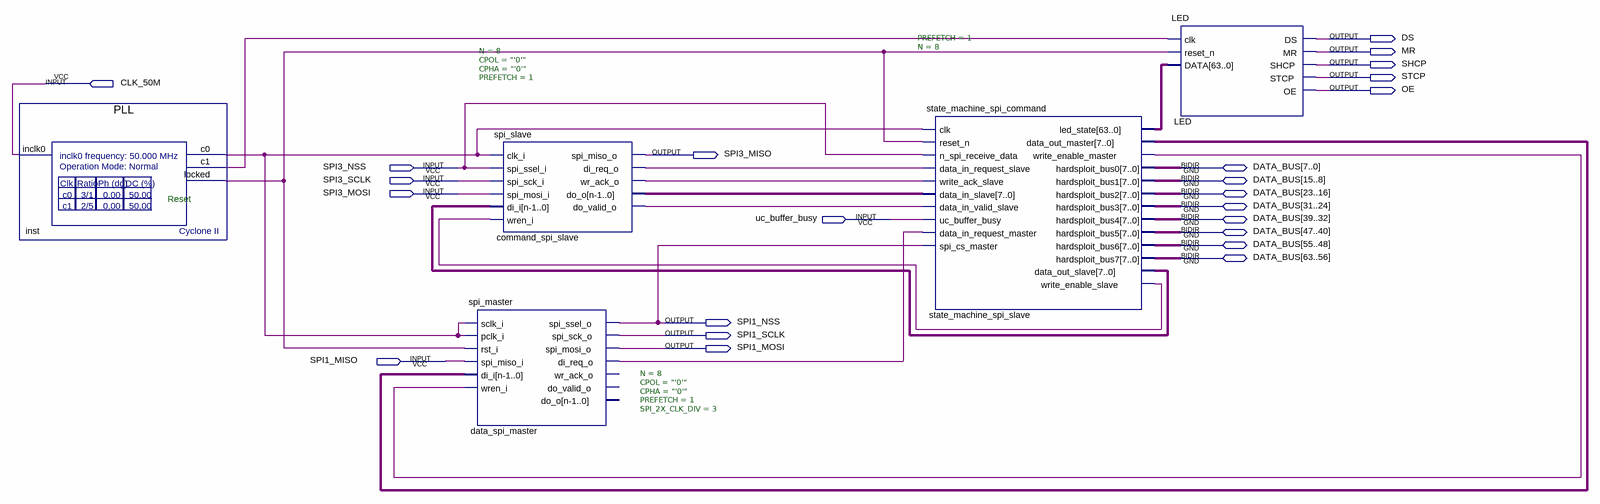
[diagram p0: schematic sheet]
// Quartus schematic HARDSPLOIT_TEMPLATE.bdf as structural Verilog: 5 symbols, 23 pins
module HARDSPLOIT_TEMPLATE (
  input  CLK_50M,
  input  SPI3_NSS,
  input  SPI3_SCLK,
  input  SPI3_MOSI,
  input  uc_buffer_busy,
  input  SPI1_MISO,
  inout  [63:0] DATA_BUS,
  output DS,
  output MR,
  output SHCP,
  output STCP,
  output OE,
  output SPI3_MISO,
  output SPI1_NSS,
  output SPI1_SCLK,
  output SPI1_MOSI
);

  wire command_spi_slave_di_req_o, command_spi_slave_do_valid_o, command_spi_slave_wr_ack_o,
       data_spi_master_di_req_o, inst_c0, inst_c1, inst_locked, state_machine_spi_slave_write_enable_master,
       state_machine_spi_slave_write_enable_slave;
  wire [7:0] command_spi_slave_do_o, state_machine_spi_slave_data_out_master,
       state_machine_spi_slave_data_out_slave;
  wire [63:0] state_machine_spi_slave_led_state;

  PLL inst (.inclk0(CLK_50M), .c0(inst_c0), .c1(inst_c1), .locked(inst_locked));
  spi_master #(.N(8), .CPOL("'0'"), .CPHA("'0'"), .PREFETCH(1), .SPI_2X_CLK_DIV(3)) data_spi_master (
    .sclk_i(inst_c0), .pclk_i(inst_c0), .rst_i(inst_locked), .spi_miso_i(SPI1_MISO),
    .di_i(state_machine_spi_slave_data_out_master), .wren_i(state_machine_spi_slave_write_enable_master),
    .spi_ssel_o(SPI1_NSS), .spi_sck_o(SPI1_SCLK), .spi_mosi_o(SPI1_MOSI), .di_req_o(data_spi_master_di_req_o));  // open: wr_ack_o, do_valid_o, do_o
  spi_slave #(.N(8), .CPOL("'0'"), .CPHA("'0'"), .PREFETCH(1)) command_spi_slave (
    .clk_i(inst_c0), .spi_ssel_i(SPI3_NSS), .spi_sck_i(SPI3_SCLK), .spi_mosi_i(SPI3_MOSI),
    .di_i(state_machine_spi_slave_data_out_slave), .wren_i(state_machine_spi_slave_write_enable_slave),
    .spi_miso_o(SPI3_MISO), .di_req_o(command_spi_slave_di_req_o), .wr_ack_o(command_spi_slave_wr_ack_o),
    .do_o(command_spi_slave_do_o), .do_valid_o(command_spi_slave_do_valid_o));
  state_machine_spi_command #(.PREFETCH(1), .N(8)) state_machine_spi_slave (
    .clk(inst_c0), .reset_n(inst_locked), .n_spi_receive_data(SPI3_NSS),
    .data_in_request_slave(command_spi_slave_di_req_o), .write_ack_slave(command_spi_slave_wr_ack_o),
    .data_in_slave(command_spi_slave_do_o), .data_in_valid_slave(command_spi_slave_do_valid_o),
    .uc_buffer_busy(uc_buffer_busy), .data_in_request_master(data_spi_master_di_req_o),
    .spi_cs_master(SPI1_NSS), .led_state(state_machine_spi_slave_led_state),
    .data_out_master(state_machine_spi_slave_data_out_master),
    .write_enable_master(state_machine_spi_slave_write_enable_master),
    .data_out_slave(state_machine_spi_slave_data_out_slave),
    .write_enable_slave(state_machine_spi_slave_write_enable_slave), .hardsploit_bus0(DATA_BUS[7:0]),
    .hardsploit_bus1(DATA_BUS[15:8]), .hardsploit_bus2(DATA_BUS[23:16]), .hardsploit_bus3(DATA_BUS[31:24]),
    .hardsploit_bus4(DATA_BUS[39:32]), .hardsploit_bus5(DATA_BUS[47:40]), .hardsploit_bus6(DATA_BUS[55:48]),
    .hardsploit_bus7(DATA_BUS[63:56]));
  LED LED (
    .clk(inst_c1), .reset_n(inst_locked), .DATA(state_machine_spi_slave_led_state), .DS(DS), .MR(MR),
    .SHCP(SHCP), .STCP(STCP), .OE(OE));

  // Notes on the sheet:
  //   Reset
endmodule
